# Altium schematic sheet Battery and Power.SchDoc
size A3; Address1: ECE Department; Address2: University of Canterbury; Address3: Christchurch 8041; Address4: New Zealand; Revision: 1
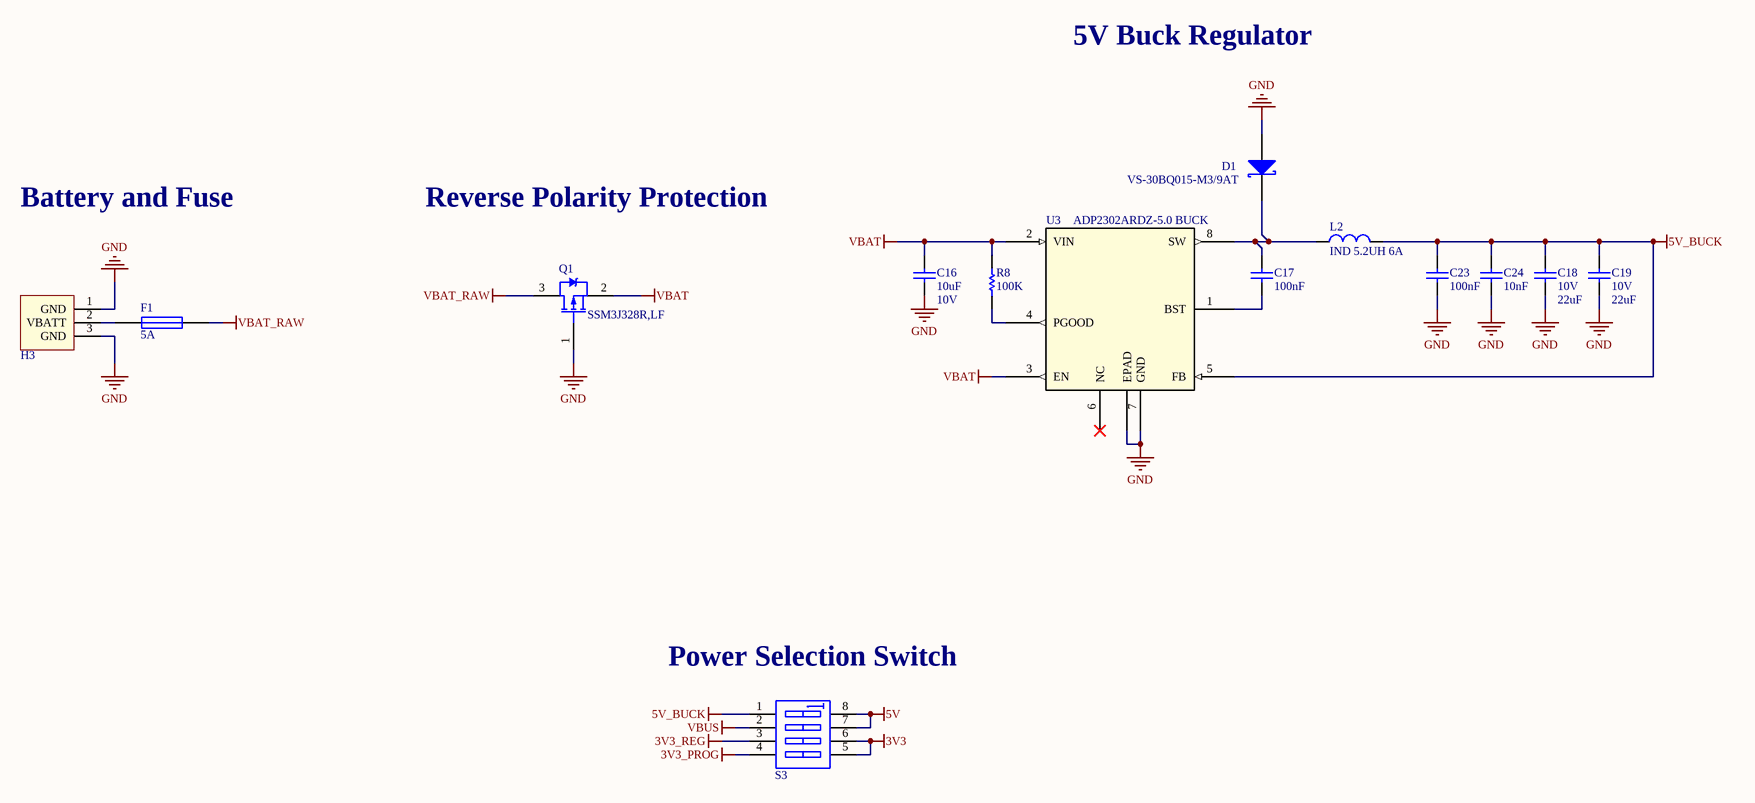
[diagram p0: Battery and Power.SchDoc]

## Parts
C16  Max Voltage: 10V  [CAPC2012L]  (hidden comment: 10uF)
C17  100nF  [CAPC1608L]
C18  Max Voltage: 10V  [CAPC3216L]  (hidden comment: 22uF)
C19  Max Voltage: 10V  [CAPC3216L]  (hidden comment: 22uF)
C23  100nF  [CAPC1608L]
C24  10nF  [CAPC1608L]
D1  VS-30BQ015-M3/9AT  [SMC]
F1  5A  [RESC3216N]
H3  Battery_HEADER_3pin  [BATT_HEADER_3POS]  (value not drawn)
L2  IND 5.2UH 6A  [INDUCTOR5u2]
Q1  SSM3J328R,LF  [SOT23_L]
R8  100K  [RESC1608L]
S3  WS_SW DIP-4  [DIP_SW_4WAY_SMD -]  (value not drawn)
U3  ADP2302ARDZ-5.0 BUCK  [RD_8_1]

## Nets
3V3: S3.5(B4) S3.6(B3)
3V3_PROG: S3.4(A4)
3V3_REG: S3.3(A3)
5V: S3.7(B2) S3.8(B1)
5V_BUCK: C18.2 C19.2 C23.2 C24.2 L2.2 S3.1(A1) U3.5(FB)
GND: C16.1 C18.1 C19.1 C23.1 C24.1 D1.1(A) H3.1(GND) H3.3(GND) Q1.1 U3.7(GND) U3.EPAD
VBAT: C16.2 Q1.2 R8.2 U3.2(VIN) U3.3(EN)
VBAT_RAW: F1.2 Q1.3
VBUS: S3.2(A2)
NetC17_1: C17.1 U3.1(BST)
NetC17_2: C17.2 D1.2(K) L2.1 U3.8(SW)
NetF1_1: F1.1 H3.2(VBATT)
NetR8_1: R8.1 U3.4(PGOOD)

Not connected (* = marked no-connect by the designer): U3 6(NC)*

## Notes on the sheet
- 5V Buck Regulator
- Battery and Fuse
- Reverse Polarity Protection
- (near S3) Power Selection Switch
- Title
- Drawn by:
- Date:
- Time:
- Revision:
- Sheet
- of
- File:

## Library data of the parts
C16 = CC_10uF_0805_10V: CAP CER 10uF X7R +-20% 10V 0805; Note: Footprint corresponds to dimensions for bulk cassette packaging. This case size has tightened tolerances.; PackageReference: 0805; Code_IPC: 2012[0805]; Verify: *; Supplier: ECE Dept; Storage Location: PCB Assembly WS; Value: 10uF
C17 C23 = CC_100nF_0603: CAP CER 100nF X7R +-10% 50V 0603; PackageReference: 0603; Code_IPC: 1608 [0603]; Verify: *; Supplier: ECE Dept; Storage Location: PCB Assembly WS; Value: 100nF
C18 C19 = CC_22uF_1206: CAP CER 22uF Y5V -20% +80% 10V 1206; Verify: *; Supplier: ECE Dept; Storage Location: PCB Assembly WS; Dielectric: Y5V; Footprint: 1206 (3216 metric); Value: 22uF
C24 = CC_10nF_0603: CAP CER 10nF X7R +-10% 50V 0603; PackageReference: 0603; Code_IPC: 1608 [0603]; Verify: *; Supplier: ECE Dept; Storage Location: PCB Assembly WS; Value: 10nF
D1 = DS_VS-30BQ015-M3: DIODE, SCHOTTKY, 3A, 15V, DO-214AB / SMC; Manufacturer: Vishay Semiconductors; Forward Voltage: 350mV; Max Forward Surge Current (Ifsm): 650A; Peak Reverse Current: 4mA; Average Rectified Current: 3A; Max Reverse Voltage (DC): 15V; Supplier: Digi-Key; ComponentLink1URL: https://datasheet.ciiva.com/36181/vs-30bq015-m3-9at-36181258.pdf; ComponentLink1Description: https://datasheet.ciiva.com/36181/vs-30bq015-m3-9at-36181258.pdf; Supplier 1: Digi-Key; Supplier 2: Element14; Supplier Part Number 1: VS-30BQ015-M3/9ATGIDKR-ND; Supplier Part Number 2: 2628288; Supplier Part Number: VS-30BQ015-M3/9AT-ND; Manufacturer Part Number: VS-30BQ015-M3/9AT
F1 = FS_Fuse_5.0A: Fuse 5.0A Fast Acting 1206 SMD; Manufacturer Part Number: C1F5; Manufacturer: Bel TRP; Voltage Rating (AC): 125V; Voltage Rating (DC): 63V; DC Cold Resistance: 19mR; Fuse Type: Board Mount (Cartridge Style Excluded); Approvals: CE,cURus; Mount: Surface Mount; Case/Package: 1206; Number of Pins: 2; Case Code (Metric): 3216; Case Code (Imperial): 1206; Contact Plating: Nickel,Tin; Min Operating Temperature: -55°C; Max Operating Temperature: 125°C; Packaging: Tape and Reel; Voltage Rating: 125V; Length: 0.126inch; Width: 0.062inch; Supplier 1: Digi-Key; Stock 1: 725; Pricing 1: 1=0.32, 5=0.312, 10=0.298, 50=0.2662, 100=0.2479, 250=0.22032, 500=0.1836, 1000=0.17442 (USD); ComponentLink1URL: http://www.farnell.com/datasheets/2571625.pdf; ComponentLink1Description: http://www.farnell.com/datasheets/2571625.pdf; ComponentLink2URL: http://belfuse.com/pdfs/C1F.pdf; ComponentLink2Description: http://belfuse.com/pdfs/C1F.pdf; ComponentLink3URL: http://www.mouser.com/ds/2/643/C1F-594910.pdf; ComponentLink3Description: http://www.mouser.com/ds/2/643/C1F-594910.pdf; ComponentLink4URL: https://belfuse.com/resources/StewartConnector/C1F.pdf; ComponentLink4Description: https://belfuse.com/resources/StewartConnector/C1F.pdf; Current Rating: 5A; Supplier Part Number 1: 507-1886-1-ND; Supplier 2: Element14; Supplier Part Number 2: 2848595; Value: 5A
H3 = Battery_HEADER_3pin: 3Pin Header 2.54mm spacing
L2 = CDRH104RNP-5R2NC: FIXED IND 5.2UH 6A 22 MOHM SMD; Manufacturer: Sumida America Components Inc.; Material - Core: Ferrite; Tolerance: ±30%; Current - Saturation: 5.6A; Shielding: Shielded; DC Resistance (DCR): 22 mOhm Max; Supplier 1: Digi-Key; Manufacturer Part Number: CDRH104RNP-5R2NC; RoHS: RoHS Compliant; Category: Inductors, Coils, Chokes; Stock 1: 3849; Pricing 1: 1=2.9, 10=2.678, 100=1.8743, 500=1.5173 (NZD); Packaging: Cut Tape (CT); Part Status: Active; Type: -; Q @ Freq: -; Frequency - Self Resonant: -; Ratings: -; Operating Temperature: -40°C ~ 100°C; Mounting Type: Surface Mount; Package / Case: Nonstandard; Supplier Device Package: -; Size / Dimension: 0.402" L x 0.394" W (10.20mm x 10.00mm); Height - Seated (Max): 0.157" (4.00mm); ComponentLink1URL: http://products.sumida.com/products/pdf/CDRH104R.pdf; ComponentLink1Description: http://products.sumida.com/products/pdf/CDRH104R.pdf; Supplier Part Number 1: 308-2280-1-ND
Q1 = TM_SSM3J328R: MOSFET P-CH 20V 6A SOT23-3; Manufacturer: Toshiba; FET Feature: Logic Level Gate, 1.5V Drive; FET Type: MOSFET P-Channel, Metal Oxide; Gate Charge (Qg) @ Vgs: 12.8nC @ 4.5V; Input Capacitance (Ciss) @ Vds: 840pF @ 10V; Power - Max: 1W; Rds On Max: 29.8mR; Drain to Source Resistance: 47.4mR; Turn-On Delay Time: 32ns; Power Dissipation: 2W; Number of Channels: 1; Turn-Off Delay Time: 107ns; Gate to Source Voltage (Vgs): 8V; Input Capacitance: 840pF; Element Configuration: Single; Drain to Source Breakdown Voltage: -20V; Vgs(th) (Max) @ Id: 1V @ 1mA; Current - Continuous Drain (Id) @ 25° C: 6A; Drain to Source Voltage (Vdss): 20V; Package / Case: SOT-23-3 Flat Leads; Supplier Device Package: SOT-23F; Pricing: 1=0.79, 10=0.658, 25=0.5772, 100=0.4939, 250=0.42836, 500=0.36284, 1000=0.27972 (NZD); Storage Location: PCB Assembly WS; Supplier: Digi-Key; ComponentLink1URL: https://datasheet.ciiva.com/11158/ssm3j328r-datasheet-en-20140301-11158652.pdf; ComponentLink1Description: https://datasheet.ciiva.com/11158/ssm3j328r-datasheet-en-20140301-11158652.pdf; Supplier Part Number: SSM3J328RLFDKR-ND; Max Operating Temperature: 150°C; Mount: Surface Mount; Packaging: Tape and Reel; Min Operating Temperature: -55°C; Continuous Drain Current (ID): 6A; Radiation Hardening: No; Max Power Dissipation: 1W; Package Quantity: 3000; Case/Package: SOT-23-3; Number of Pins: 3; Number of Elements: 1; Supplier 1: Digi-Key; Supplier Part Number 1: SSM3J328RLFDKR-ND; Manufacturer Part Number: SSM3J328R,LF
R8 = RS_100K: RES 100K OHM 1/10W 5% 0603 SMD; Storage Location: PCB Assembly WS; Supplier: ECE Dept; Value: 100K
S3 = WS_SW DIP-4: DIP Switch, 4 Position, SPST SMD; Manufacturer: OMRON ELECTRONIC COMPONENTS; Manufacturer Part Number: A6SN-4101; Contact Current DC Max: 25; External Length / Height: 12.1; No. of Switch Positions: 4; Pitch Spacing: 2.54; Contact Configuration: SPST; Supplier 1: Farnell; Supplier Part Number 1: 2029425; Storage Location: PCB Assembly WS; Supplier: ECE Dept
U3 = ADP2302ARDZ-5.0-R7: IC REG BUCK 5V 2A 8SOIC; Vendor: Analog Devices Inc; Frequency - Switching: 700kHz; Output Type: Fixed; Voltage - Input (Max): 20V; Manufacturer_Part_Number: ADP2302ARDZ-5.0-R7; Type: DEV; Value: Value; Supplier 1: Digi-Key; Current - Output: 2A; Voltage - Output (Min/Fixed): 5V; Supplier Part Number 1: ADP2302ARDZ-5.0-R7CT-ND